# EAGLE design Einbau_2out_0.1 (EAGLE 5.04)
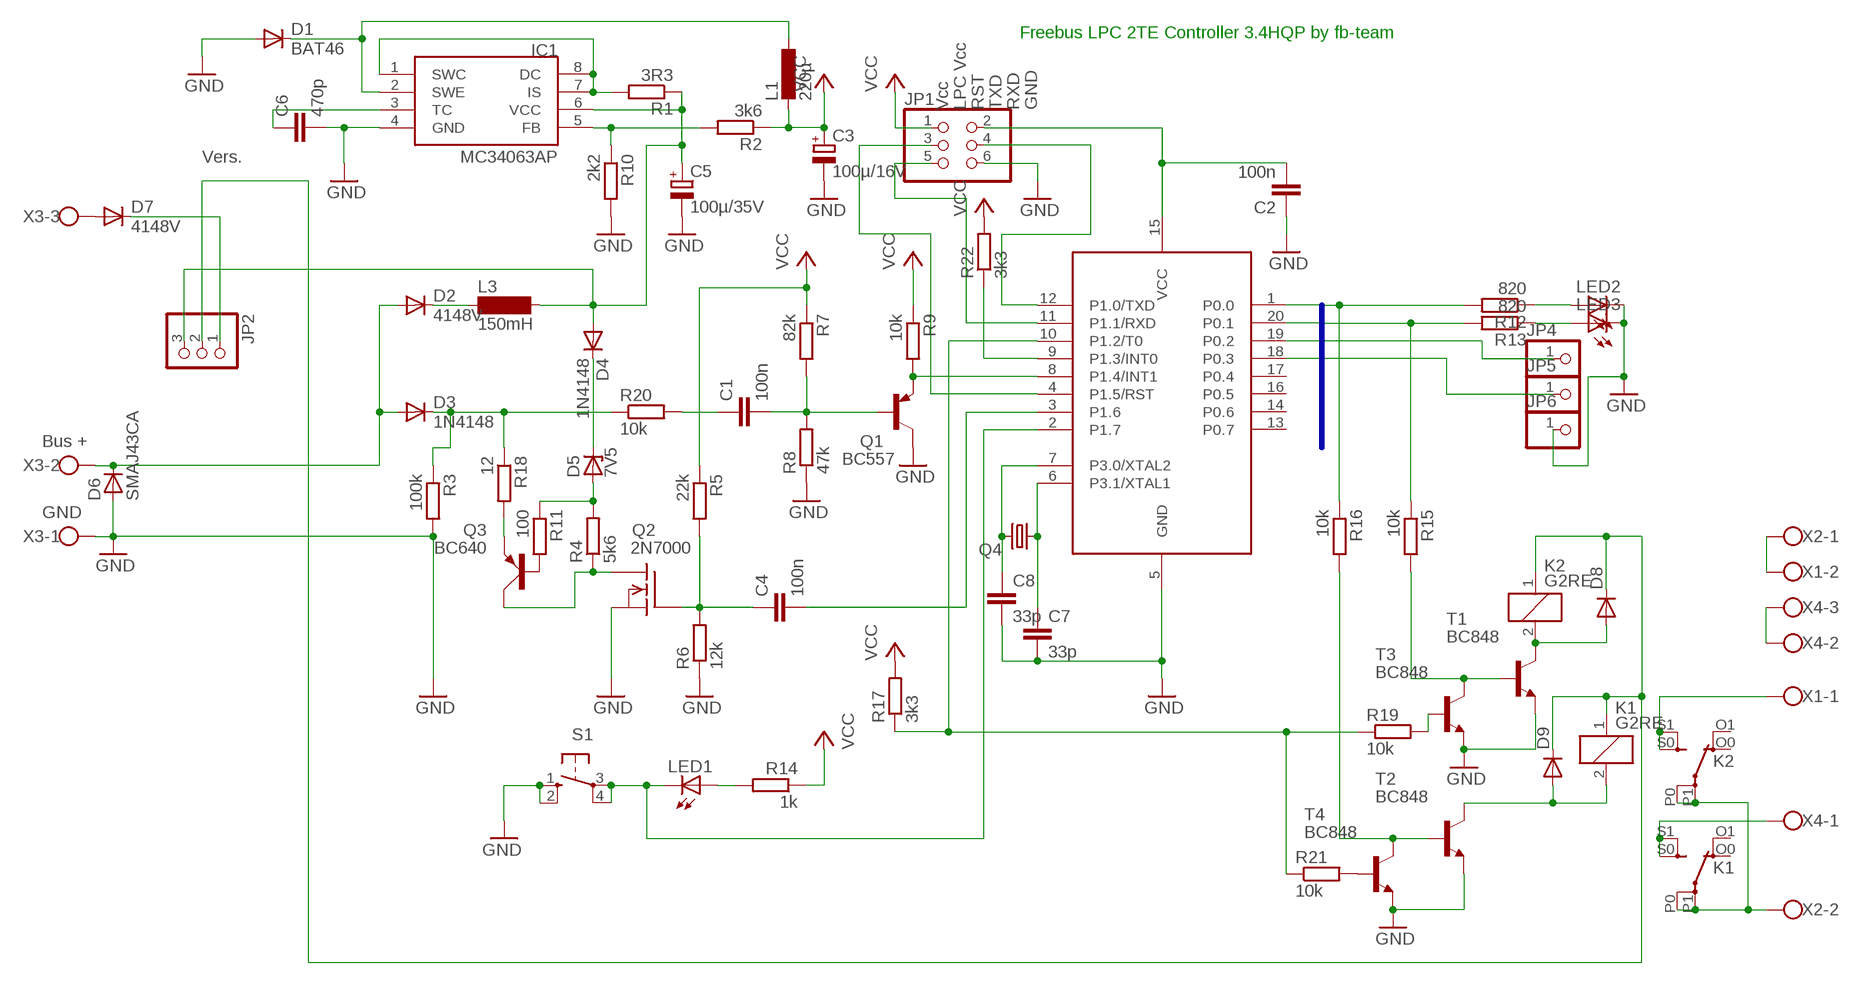
[diagram p0: schematic, sheet 1]

## Parts
C1  100n  C-EU050-024X044  [C050-024X044]
C2  100n  C-EU050-024X044  [C050-024X044]
C3  100µ/16V  CPOL-EUE2.5-5  [E2,5-5]
C4  100n  C-EU050-024X044  [C050-024X044]
C5  100µ/35V  CPOL-EUE3.5-8  [E3,5-8]
C6  470p  C-EU025-024X044  [C025-024X044]
C7  33p  C-EU025-025X050  [C025-025X050]
C8  33p  C-EU025-025X050  [C025-025X050]
D1  BAT46  BAT81  [DO34-7]
D2  4148V  1N41481448V  [D-2.5]
D3  1N4148  1N41481448V  [D-2.5]
D4  1N4148  1N41481448V  [D-2.5]
D5  7V5  ZPD  [DO35Z10]
D6  SMAJ43CA  D-SMB  [SMB]
D7  4148V  1N41481448V  [D-2.5]
D8  DIODE-MINIMELF  [MINIMELF]
D9  DIODE-MINIMELF  [MINIMELF]
IC1  MC34063AP  [DIL08]
JP1  PINHD-2X3  [2X03]
JP2  PINHD-1X3  [1X03]
JP4  PINHD-1X1  [1X01]
JP5  PINHD-1X1  [1X01]
JP6  PINHD-1X1  [1X01]
K1  G2RE  [G2RE]
K2  G2RE  [G2RE]
L1  220µ  L-EU0207/5V  [0207/5V]
L3  150mH  BS11  [BS11]
LED1  LED3MM  [LED3MM]
LED2  LED3MM  [LED3MM]
LED3  LED3MM  [LED3MM]
Q1  BC557  [TO92]
Q2  2N7000  VN2222KM  [TO237]
Q3  BC640  [SOT54D]
Q4  CRYSTALHC49S  [HC49/S]
R1  3R3  R-EU_0207/2V  [0207/2V]
R2  3k6  R-EU_0207/5V  [0207/5V]
R3  100k  R-EU_0207/2V  [0207/2V]
R4  5k6  R-EU_0207/2V  [0207/2V]
R5  22k  R-EU_0207/2V  [0207/2V]
R6  12k  R-EU_0207/2V  [0207/2V]
R7  82k  R-EU_0207/2V  [0207/2V]
R8  47k  R-EU_0207/2V  [0207/2V]
R9  10k  R-EU_0207/2V  [0207/2V]
R10  2k2  R-EU_0207/2V  [0207/2V]
R11  100  R-EU_0207/2V  [0207/2V]
R12  820  R-EU_R1206  [R1206]
R13  820  R-EU_R1206  [R1206]
R14  1k  R-EU_0207/2V  [0207/2V]
R15  10k  R-EU_R1206  [R1206]
R16  10k  R-EU_R1206  [R1206]
R17  3k3  R-EU_0207/5V  [0207/5V]
R18  12  R-EU_0207/2V  [0207/2V]
R19  10k  R-EU_R1206  [R1206]
R20  10k  R-EU_0207/2V  [0207/2V]
R21  10k  R-EU_R1206  [R1206]
R22  3k3  R-EU_0207/5V  [0207/5V]
S1  10-XX  [B3F-10XX]
T1  BC848  [SOT23]
T2  BC848  [SOT23]
T3  BC848  [SOT23]
T4  BC848  [SOT23]
U1  89LPC922  [DIL20]
X1  W237-02P  [W237-132]
X2  W237-02P  [W237-132]
X3  W237-3E  [W237-3E]
X4  W237-03P  [W237-133]

## Nets
EIB+: D2.A D3.A D6.1(C) X3.2
GND: C2.1 C3.- C5.- C6.2 C7.2 C8.2 D1.A D6.2(A) IC1.4(GND) JP1.6 JP6.1 LED2.K(C) LED3.K(C) Q1.3(C) Q2.3(S) R3.2 R6.1 R8.1 R10.2 S1.1(S) S1.2(S1) T1.2(E) T2.2(E) T3.2(E) T4.2(E) U1.5(GND) X3.1
HAND: R22.1 U1.9(P1.3/INT0)
N$1: Q1.1(E) R9.2 U1.8(P1.4/INT1)
N$2: C1.2 Q1.2(B) R7.2 R8.2
N$3: R21.2 T4.1(B)
N$4: D3.C R3.1 R18.1 R20.1
N$5: C4.2 U1.3(P1.6)
N$6: X4.2 X4.3
N$7: LED1.K(C) S1.3(P) S1.4(P1) U1.2(P1.7)
N$8: IC1.1(SWC) IC1.7(IS) IC1.8(DC) R1.2
N$9: LED1.A R14.2
N$10: C5.+ D4.A IC1.6(VCC) JP2.3 L3.2 R1.1
N$11: IC1.5(FB) R2.2 R10.1
N$12: D1.C IC1.2(SWE) L1.1
N$13: D2.C L3.1
N$14: C6.1 IC1.3(TC)
N$15: D4.C D5.C
N$16: X1.2 X2.1
N$17: K1.S0(2:S) K1.S1(2:S) X4.1
N$19: D9.A K1.2 T2.3(C)
N$20: LED2.A R12.1
N$21: LED3.A R13.1
N$23: D7.C JP2.1
N$24: D8.A K2.2 T1.3(C)
N$25: D5.A R4.2 R11.1
N$26: Q2.1(D) Q3.C R4.1
N$27: K2.S0(2:S) K2.S1(2:S) X1.1
N$28: Q3.B R11.2
N$29: JP1.4 U1.12(P1.0/TXD)
N$30: JP1.5 U1.11(P1.1/RXD)
N$31: JP1.3 U1.4(P1.5/RST)
N$32: C2.2 JP1.2 U1.15(VCC)
N$33: Q3.E R18.2
N$34: C4.1 Q2.2(G) R5.2 R6.2
N$35: R15.2 T1.1(B) T3.3(C)
N$36: D7.A X3.3
N$37: R16.2 T2.1(B) T4.3(C)
N$38: JP4.1 U1.19(P0.2)
N$39: JP5.1 U1.18(P0.3)
N$41: C1.1 R20.2
N$43: R19.2 T3.1(B)
N$46: K1.P0(2:P) K1.P1(2:P) K2.P0(2:P) K2.P1(2:P) X2.2
P0.0: R12.2 R16.1 U1.1(P0.0)
P0.1: R13.2 R15.1 U1.20(P0.1)
PWM: R17.1 R19.1 R21.1 U1.10(P1.2/T0)
VCC: C3.+ JP1.1 L1.2 R2.1 R5.1 R7.1 R9.1 R14.1 R17.2 R22.2
VDD_IN: D8.C D9.C JP2.2 K1.1 K2.1
XTAL1: C7.1 Q4.1 U1.6(P3.1/XTAL1)
XTAL2: C8.1 Q4.2 U1.7(P3.0/XTAL2)
Unconnected: K1.O0(2:O) K1.O1(2:O) K2.O0(2:O) K2.O1(2:O) U1.13(P0.7) U1.14(P0.6) U1.16(P0.5) U1.17(P0.4)

## Buses
P0.[0..3]

## Notes on the sheet
- Freebus LPC 2TE Controller 3.4HQP by fb-team
- Vcc | LPC Vcc | RST | TXD | RXD | GND
- Vers.
- Bus +
- GND

## Library data of the parts
C1 C2 C4 C6-C8 = rcl:C-EU: CAPACITOR, European symbol
C3 C5 = rcl:CPOL-EU: POLARIZED CAPACITOR, European symbol
D1 = diode:BAT81: DIODE barrier diode
D2-D4 D7 = diode:1N4148: DIODE high speed (Philips)
D5 = diode:ZPD: Z DIODE 500 mW
D6 = semicon-smd-ipc:D-: DIODE unfilled
D8 D9 = diode:DIODE-: DIODE
IC1 = mc34063:MC34063
JP1 = pinhead:PINHD-2X3: PIN HEADER
JP2 = pinhead:PINHD-1X3: PIN HEADER
JP4-JP6 = pinhead:PINHD-1X1: PIN HEADER
K1 K2 = relay:G2RE: RELAY 1 x switch, high current, Omron
L1 = rcl:L-EU: INDUCTOR, European symbol
L3 = inductor-neosid:BS: INDUCTOR nominal inductance, magnetically screened
LED1-LED3 = led:LED: LED OSRAM: - CHIPLED LG R971, LG N971, LY N971, LG Q971, LY Q971, LO R971, LY R971 LH N974, LH R974 LS Q976, LO Q976, LY Q976 LO Q996 - Hyper CHIPLED LW Q18S LB Q993, LB Q99A, LB R99A - SideLED LS A670, LO A670, LY A670, LG A670, LP A670 LB A673, LV A673, LT A673, LW A673 LH A674 LY A675 LS A676, LA A676, LO A676, LY A676, LW A676 LS A679, LY A679, LG A679 - Hyper Micro SIDELED® LS Y876, LA Y876, LO Y876, LY Y876 LT Y87S - SmartLED LW L88C, LW L88S LB L89C, LB L89S, LG L890 LS L89K, LO L89K, LY L89K LS L896, LA L896, LO L896, LY L896 - TOPLED LS T670, LO T670, LY T670, LG T670, LP T670 LSG T670, LSP T670, LSY T670, LOP T670, LYG T670 LG T671, LOG T671, LSG T671 LB T673, LV T673, LT T673, LW T673 LH T674 LS T676, LA T676, LO T676, LY T676, LB T676, LH T676, LSB T676, LW T676 LB T67C, LV T67C, LT T67C, LS T67K, LO T67K, LY T67K, LW E67C LS E67B, LA E67B, LO E67B, LY E67B, LB E67C, LV E67C, LT E67C LW T67C LS T679, LY T679, LG T679 LS T770, LO T770, LY T770, LG T770, LP T770 LB T773, LV T773, LT T773, LW T773 LH T774 LS E675, LA E675, LY E675, LS T675 LS T776, LA T776, LO T776, LY T776, LB T776 LHGB T686 LT T68C, LB T68C - Hyper Mini TOPLED® LB M676 - Mini TOPLED Santana® LG M470 LS M47K, LO M47K, LY M47K Source: http://www.osram.convergy.de - LUMILED® LXK2-PW12-R00, LXK2-PW12-S00, LXK2-PW14-U00, LXK2-PW14-V00 LXK2-PM12-R00, LXK2-PM12-S00, LXK2-PM14-U00 LXK2-PE12-Q00, LXK2-PE12-R00, LXK2-PE12-S00, LXK2-PE14-T00, LXK2-PE14-U00 LXK2-PB12-K00, LXK2-PB12-L00, LXK2-PB12-M00, LXK2-PB14-N00, LXK2-PB14-P00, LXK2-PB14-Q00 LXK2-PR12-L00, LXK2-PR12-M00, LXK2-PR14-Q00, LXK2-PR14-R00 LXK2-PD12-Q00, LXK2-PD12-R00, LXK2-PD12-S00 LXK2-PH12-R00, LXK2-PH12-S00 LXK2-PL12-P00, LXK2-PL12-Q00, LXK2-PL12-R00 Source: www.luxeon.com
Q1 = transistor-pnp:BC557: PNP Transistor
Q2 = transistor-fet:VN2222KM: N-Channel Enhancement MOSFET (VMOS); 60V; 0,5A; 7,5Ohm
Q3 = transistor-small-signal:BC640: PNP TRANSISTOR
Q4 = crystal:CRYSTAL: CRYSTAL
R1-R22 = rcl:R-EU_: RESISTOR, European symbol
S1 = switch-omron:10-XX: OMRON SWITCH
T1-T4 = transistor:BC848: NPN TRANSISTOR
U1 = micro-philips:89LPC922
X1 X2 = con-wago-508:W237-02P: WAGO SREW CLAMP
X3 = con-wago-508:W237-3E: WAGO SREW CLAMP
X4 = con-wago-508:W237-03P: WAGO SREW CLAMP

## Board
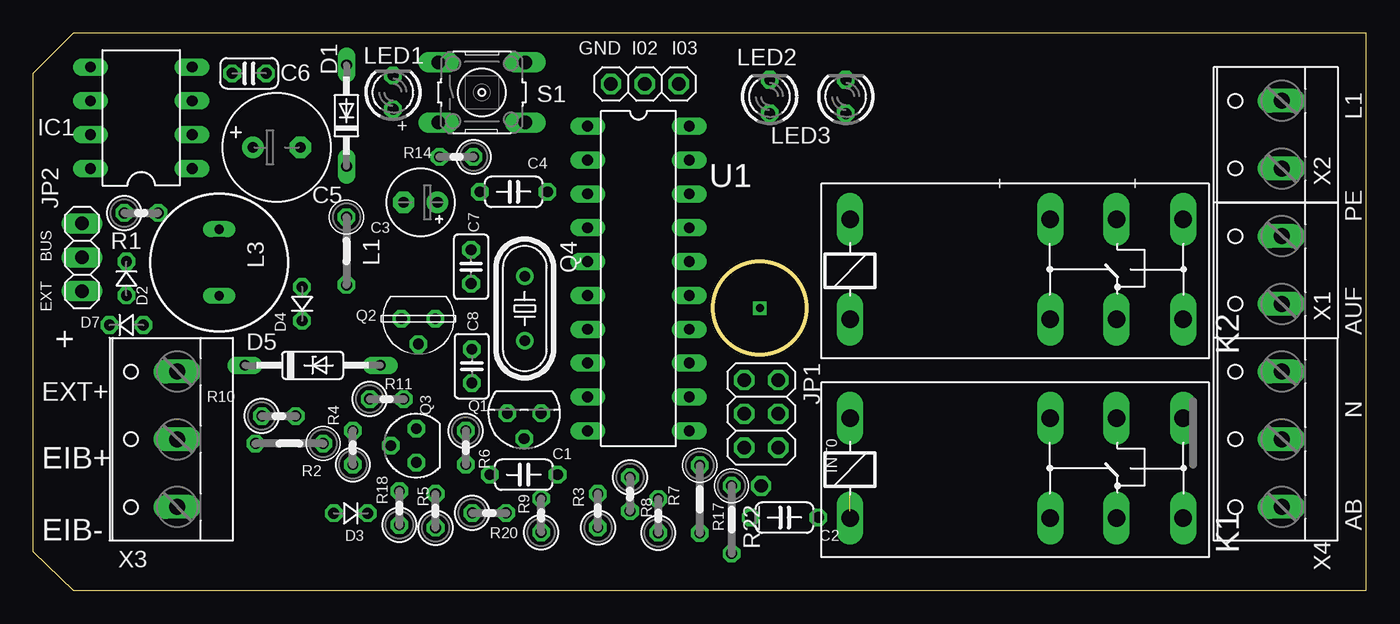
[diagram p1: board, top side]
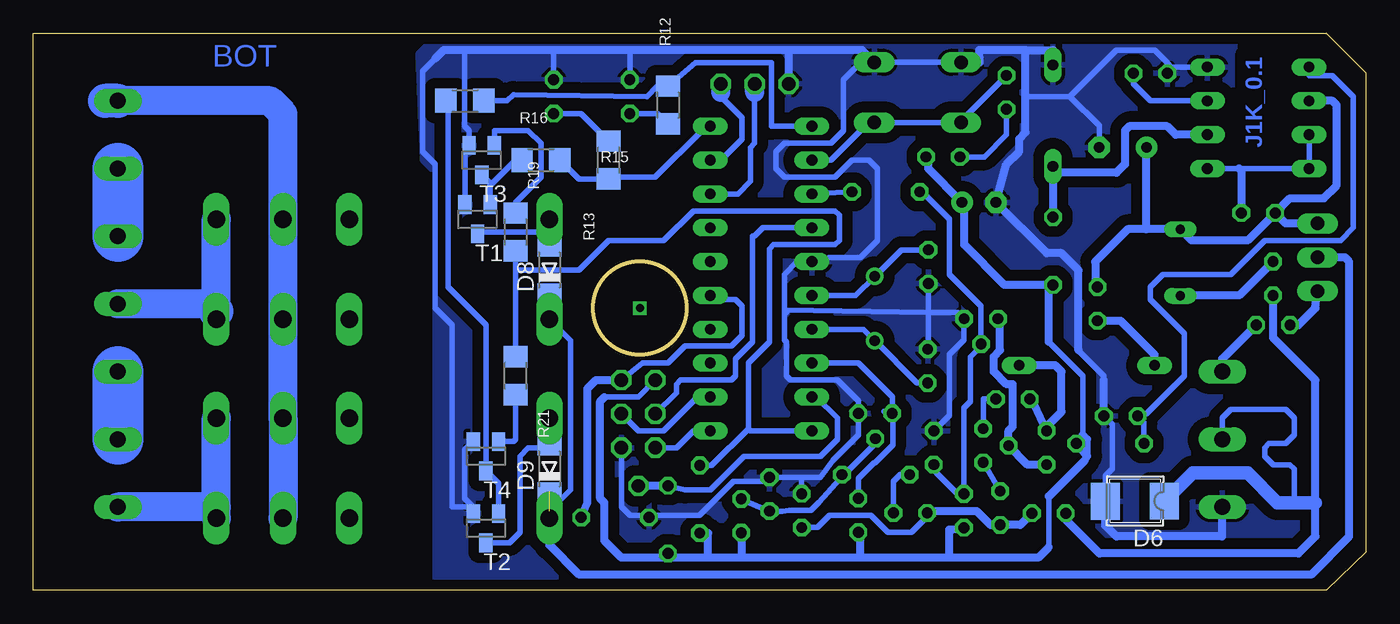
[diagram p2: board, bottom side, seen from below]

Size 100 x 41.8 mm. Coordinates in mm from the lower left corner, seen from the top.
Outline: 0,2.9 3,0 100,0 100,41.8 3,41.8 0,38.8 0,2.9
Outline: circle at 54.5,21.17 radius 3.49
Copper layers (1*16): Top 0.035mm / dielectric 1.5mm / Bottom 0.035mm
Design rules "default *": minimum track width 10mil, minimum drill 24mil, track to track 8mil, track to pad 8mil, pad to pad 8mil, via to via 8mil, smd to smd 8mil, copper to edge 25mil, drill to drill 8mil, minimum pad ring 10mil, minimum via ring 8mil, stop-mask expansion 4mil, vias tented up to drill 0mil, thermal gap 10mil

### Footprints (pad centres in the part's own frame; a part is rotated, then mirrored left to right if it is on the bottom)
C050-024X044 = drill 0.813 octagon: 1 -2.54,0; 2 2.54,0
E2,5-5 = drill 0.813 pad 1.6 round: + -1.27,0 | drill 0.813 pad 1.6 octagon: - 1.27,0
E3,5-8 = drill 0.813 pad 1.6 round: + -1.778,0 | drill 0.813 pad 1.6 octagon: - 1.778,0
C025-024X044 = drill 0.813 octagon: 1 -1.27,0; 2 1.27,0
C025-025X050 = drill 0.813 octagon: 1 -1.27,0; 2 1.27,0
DO34-7 = drill 0.813 long: A 3.81,0; C -3.81,0
D-2.5 = drill 0.813 octagon: A 1.27,0; C -1.27,0
DO35Z10 = drill 0.813 long: A 5.08,0; C -5.08,0
SMB = smd 2.159 x 2.743: 1 -2.311,-0.127; 2 2.108,-0.102
MINIMELF = smd 1.4 x 1.8: A 1.7,0; C -1.7,0
DIL08 = drill 0.813 long: 1 -3.81,-3.81; 2 -1.27,-3.81; 3 1.27,-3.81; 4 3.81,-3.81; 5 3.81,3.81; 6 1.27,3.81; 7 -1.27,3.81; 8 -3.81,3.81
2X03 = drill 1.016 octagon: 1 -2.54,-1.27; 2 -2.54,1.27; 3 0,-1.27; 4 0,1.27; 5 2.54,-1.27; 6 2.54,1.27
1X03 = drill 1.016 long: 1 -2.54,0; 2 0,0; 3 2.54,0
1X01 = drill 1.016 octagon: 1 0,0
G2RE = drill 1.321 long: 1 -2.54,-3.683; 2 -2.54,3.81; O0 12.471,-3.683; O1 12.471,3.81; P0 17.45,-3.683; P1 17.45,3.81; S0 22.454,-3.683; S1 22.454,3.81
0207/5V = drill 0.813 octagon: 1 -2.54,0; 2 2.54,0
BS11 = drill 0.7 long: 1 -2.5,0; 2 2.5,0
LED3MM = drill 0.813 octagon: A -1.27,0; K 1.27,0
TO92 = drill 0.813 octagon: 1 1.27,0; 2 0,1.905; 3 -1.27,0
TO237 = drill 0.813 octagon: 1 1.27,0; 2 0,1.905; 3 -1.27,0
SOT54D = drill 0.813 octagon: B 1.27,0; C 0,1.905; E -1.27,0
HC49/S = drill 0.813 round: 1 -2.413,0; 2 2.413,0
0207/2V = drill 0.813 octagon: 1 -1.27,0; 2 1.27,0
R1206 = smd 1.6 x 1.803: 1 -1.422,0; 2 1.422,0
B3F-10XX = drill 1.016 long: 1 -3.251,2.261; 2 3.251,2.261; 3 -3.251,-2.261; 4 3.251,-2.261
SOT23 = smd 1 x 1.4: 1 -0.95,-1.1; 2 0.95,-1.1; 3 0,1.1
DIL20 = drill 0.813 long: 1 -11.43,-3.81; 2 -8.89,-3.81; 3 -6.35,-3.81; 4 -3.81,-3.81; 5 -1.27,-3.81; 6 1.27,-3.81; 7 3.81,-3.81; 8 6.35,-3.81; 9 8.89,-3.81; 10 11.43,-3.81; 11 11.43,3.81; 12 8.89,3.81; 13 6.35,3.81; 14 3.81,3.81; 15 1.27,3.81; 16 -1.27,3.81; 17 -3.81,3.81; 18 -6.35,3.81; 19 -8.89,3.81; 20 -11.43,3.81
W237-132 = drill 1.194 long: 1 -2.54,-0.635; 2 2.54,-0.635
W237-3E = drill 1.194 long: 1 -5.08,-0.635; 2 0,-0.635; 3 5.08,-0.635
W237-133 = drill 1.194 long: 1 -5.08,-0.635; 2 0,-0.635; 3 5.08,-0.635

### Placement (x,y rotation side)
C1  36.8,8.67 0 top
C2  56.36,5.46 0 top
C3  29.05,29.11 180 top
C4  36.04,29.9 0 top
C5  18.26,33.24 0 top
C6  16.19,38.79 180 top
C7  32.85,24.28 270 top
C8  32.9,16.82 90 top
D1  23.5,35.62 90 top
D2  6.99,23.39 270 top
D3  23.81,5.77 180 top
D4  20.16,21.49 90 top
D5  20.96,16.89 0 top
D6  17.46,6.57 180 bottom
D7  6.99,19.9 0 top
D8  61.28,24.03 90 bottom
D9  61.28,9.11 90 bottom
IC1  8.1,35.46 90 top
JP1  54.61,13.24 270 top
JP2  3.65,24.98 90 top
JP4  48.42,38 0 top
JP5  45.88,38 0 top
JP6  43.34,38 0 top
K1  63.82,9.11 0 top
K2  63.82,24.03 0 top
L1  23.49,25.46 270 top
L3  13.94,24.6 90 top
LED1  26.99,37.37 90 top
LED2  55.24,37.05 90 top
LED3  60.96,37.05 90 top
Q1  36.83,13.28 180 top
Q2  28.89,20.38 180 top
Q3  28.73,10.85 90 top
Q4  36.87,21.14 270 top
R1  8.1,28.32 0 top
R2  19.21,11.01 180 top
R3  42.36,5.97 90 top
R4  23.97,10.69 90 top
R5  30.18,5.96 90 top
R6  32.44,10.7 270 top
R7  46.89,5.58 90 top
R8  44.77,7.2 270 top
R9  38.1,5.61 90 top
R10  18.42,13.08 0 top
R11  26.51,14.35 0 top
R12  52.39,36.41 90 bottom
R13  56.83,32.28 270 bottom
R14  31.75,32.52 180 top
R15  61.91,32.28 180 bottom
R16  67.63,36.73 180 bottom
R17  50,6.83 270 top
R18  27.46,6.17 90 top
R19  63.82,26.89 90 bottom
R20  34.2,5.8 0 top
R21  63.82,16.09 270 bottom
R22  52.39,5.3 270 top
S1  33.66,37.36 0 top
T1  66.67,27.84 180 bottom
T2  66.04,4.66 180 bottom
T3  66.36,32.28 180 bottom
T4  66.04,10.06 180 bottom
U1  45.4,23.39 270 top
X1  93.03,24.03 90 top
X2  93.03,34.19 90 top
X3  10.16,11.33 90 top
X4  93.03,11.33 90 top

### Tracks (layer width: path | path; a pad name or v marks a point on that pad's centre or on a via)
EIB+
  Bottom 0.406: X3.2 10.79,12.92 10.16,13.55 6.03,13.55 5.4,12.92 5.4,11.65 6.03,11.01 7.3,11.01 7.62,10.7 7.62,10.06 6.99,9.43 5.71,9.43 5.4,9.11 5.4,6.57
  Bottom 0.61: D3.A 22.54,5.3 20,2.76 5.08,2.76 3.81,4.03 3.81,6.57 3.81,15.78 6.99,18.95 6.99,22.44 D2.A
  Bottom 1.016: D6.1 15.11,6.7 13.02,8.79 8.89,8.79 6.67,6.57 5.4,6.57 3.81,6.57
GND
  Bottom 0.406: U1.5 42.7,24.66 43.66,23.71 43.66,21.01 | 42.23,8.47 40.96,8.47 40.01,9.74 38.1,11.65 Q1.3 38.1,14.19 39.69,15.78 43.18,15.78 43.5,16.09 43.5,18.63 43.66,18.79 43.66,21.01 | 42.23,8.47 R8.1 45.09,8.16 47.47,8.16 50.01,5.62 54.29,5.62 C2.1 54.61,5.62 55.24,5.62 55.88,6.25 JP1.6 | Q2.3 | 43.66,21.01 43.5,20.85 | U1.5 | U1.5 40.64,24.66 40.32,24.98 37.94,24.98 36.67,26.25 36.67,31.65 37.31,32.28 38.58,32.28 39.85,31.01 43.66,31.01 44.29,31.65 44.29,32.92 43.66,33.55 40.16,33.55 39.21,34.51 39.21,38.32 37.9,39.62 S1.2 S1.1 | R6.1 31.27,13.13 31.27,17.68 30.16,18.79 Q2.3 | Q2.3 30.64,20.85 32.86,20.85 | 43.66,21.01 32.86,20.85 | C7.2 32.86,20.85 | C8.2 32.86,18.09 32.86,20.85 | R10.2 19.05,12.44 19.05,9.11 19.57,8.59 D6.2 | 19.68,15.78 19.68,16.09 21.59,18 | C5.- 20.03,34.86 22.23,37.05 | 25.56,37.05 22.23,37.05 | 14.76,38.63 C6.2 14.92,39.59 | 14.92,39.59 15.88,40.54 18.73,40.54 22.23,37.05 | IC1.4 14.61,39.27 14.92,39.59 | R3.2 42.35,8.35 42.23,8.47 | 66.99,6.25 T2.2 | 66.99,6.25 67.63,6.89 67.63,10.52 T4.2 | T1.2 67.62,33.07 T3.2 67.31,34.5 67.63,34.82 67.63,40.54 | 66.99,6.25 68.58,6.25 68.58,19.9 69.85,21.17 69.85,31.97 70.8,32.92 70.8,38.95 69.85,39.91 | 55.24,40.54 LED2.K | 60.96,40.54 LED3.K
  Bottom 0.61: 25.56,40.54 23.5,40.54 23.5,39.75 | 25.56,40.54 29.05,40.54 29.01,39.62 S1.1 | X3.1 10.79,4.03 18.73,4.03 19.57,4.87 D6.2 | 43.34,40.54 37.82,40.54 S1.2 | 43.34,40.54 JP6.1 | 19.68,15.78 19.68,15.14 R10.2 | 25.56,40.54 25.56,37.05 25.56,34.35 26.04,33.87 26.04,32.92 26.99,31.97 C3.- 23.97,25.3 22.86,25.3 21.59,24.03 21.59,18 | 43.34,40.54 55.24,40.54 60.96,40.54 67.63,40.54 69.22,40.54 69.85,39.91
  pour Bottom (isolate 0.813): 0,3.07 0,38.95 2.86,41.81 69.85,41.49 71.12,40.22 70.8,32.28 69.85,31.33 69.85,0.54 2.54,0.54
HAND  (via drill 1)
  Bottom 0.406: U1.9 41.27,14.51 39.69,12.92 39.69,11.33 40.96,10.06 46.67,10.06 49.21,7.52 51.12,7.52 R22.1
  Bottom 0.61: R22.1 v54.61,7.84
N$1
  Bottom 0.406: R9.2 38.1,8.39 36.91,9.57 36.85,9.57 35.51,10.91 35.51,13.41 36.17,13.44 Q1.1 35.56,14.51 38.1,17.04 U1.8 | U1.8
N$2
  Bottom 0.406: 39.62,8.69 39.31,8.36 C1.2 39.48,8.36 | 39.48,8.36 39.48,8.69 | 39.48,8.36 41.06,6.61 41.66,6.01 43.27,6.01 43.82,5.93 R8.2 46.29,6.57 R7.2 | 39.48,8.36 38.85,8.99 36.51,11.33 36.87,11.33 Q1.2
N$3
  Bottom 0.406: T4.1 63.99,11.16 63.82,11.33 R21.2
N$4
  Bottom 0.406: R3.1 42.27,4.7 42.27,4.71 41.16,4.71 40.27,5.61 37.16,5.61 35.9,4.35 34.13,4.35 32.93,5.54 R20.1 32.8,5.93
  Bottom 0.61: 32.8,5.93 29.21,5.93 28.18,4.9 R18.1 25.96,4.9 D3.C
N$5
  Bottom 0.406: U1.3 | C4.2 U1.3 | U1.3
N$6
  Bottom 3.81: X4.3 X4.2
N$7
  Bottom 0.406: U1.2 | U1.2 40.16,32.28 37.34,35.1 S1.4 S1.3 30.4,35.22 LED1.K
N$8
  Bottom 0.406: IC1.1 9.84,31.65 9.53,31.65 IC1.8 IC1.7
  Bottom 0.61: R1.2 9.37,31.49 9.53,31.65
N$9
  Bottom 0.406: LED1.A 26.99,34.19 28.65,32.52 R14.2
N$10
  Bottom 0.61: JP2.3 6.03,27.52 R1.1 | R1.1 | R1.1 8.89,26.25 13.1,26.25 L3.2 16.51,27.1 | R1.1 5.71,29.43 3.17,29.43 2.22,30.38 2.22,36.41 2.54,36.73 IC1.6 | IC1.6 | 16.51,27.1 17.89,27.1 20.32,24.66 20.32,22.92 D4.A | C5.+ 16.48,27.13 16.51,27.1
N$11
  Bottom 0.406: R2.2 16.67,12.6 R10.1 16.51,13.24 13.65,16.09 13.65,19.27 16.19,21.81 16.19,22.76 15.24,23.71 10.16,23.71 7.62,26.25 1.91,26.25 0.95,27.2 0.95,37.05 2.54,38.63 4.29,38.63 IC1.5
N$12
  Bottom 0.61: L1.1 D1.C 23.02,31.33 18.73,31.33 18.1,31.97 18.1,34.51 17.78,34.82 14.92,34.82 14.29,34.19 IC1.2 | L1.1
N$13
  Bottom 0.61: D2.C 9.53,22.12 13.28,22.12 L3.1
N$14
  Bottom 0.406: IC1.3 16.19,36.73 17.46,38 C6.1
N$15
  Bottom 0.61: D5.C 15.88,17.68 18.41,20.22 D4.C | D4.C
N$16
  Bottom 3.81: X2.1 X1.2
N$17
  Bottom 1.778: K1.S0 86.27,6.25
  Bottom 2.184: 86.27,6.25 X4.1 | K1.S0 K1.S1
N$19
  Bottom 0.406: 60.96,10.38 60.96,10.49 D9.A | D9.A K1.2 | T2.3 64.28,3.56 63.5,4.35 63.5,10.06 62.87,10.7 61.39,10.7 D9.A
N$20
  Bottom 0.406: LED2.A 53.17,35.78 R12.1
N$21
  Bottom 0.406: LED3.A 58.9,35.78 R13.1
N$23
  Bottom 0.61: JP2.1 3.81,21.17 5.08,19.9 D7.C
N$24
  Bottom 0.406: D8.A K2.2 60.96,27.52 61.59,26.89 66.36,26.89 66.5,26.74 T1.3
N$25
  Bottom 0.61: R11.1 24.92,14.03 24.18,12.42 | R4.2 24.18,12.42 | 24.18,12.42 23.84,12.42 22.86,13.39 22.86,16.41 23.34,16.89 D5.A | D5.A
N$26
  Bottom 0.61: R4.1 25.4,9.43 Q3.C 26.83,11.96 26.51,12.28 26.51,15.46 26.99,15.46 27.94,16.41 27.94,17.52 27.46,18 27.46,20.22 Q2.1
N$27
  Bottom 1.778: 86.27,20.85 K2.S0 86.4,20.22
  Bottom 2.184: X1.1 86.91,21.49 86.32,20.9 86.27,20.85 | 86.27,20.94 K2.S1
  Bottom 2.54: 86.32,20.9 86.27,20.94
N$28
  Bottom 0.406: Q3.B 28.73,14.35 R11.2
N$29
  Bottom 0.406: JP1.4 54.61,11.96 52.7,11.96 50.16,14.51 U1.12 | U1.12
N$30
  Bottom 0.406: U1.11 50.48,11.96 51.75,10.7 JP1.5
N$31
  Bottom 0.406: U1.4 45.24,27.2 45.88,26.57 46.04,26.57 46.04,18.63 47.31,17.36 47.31,16.09 47.62,15.78 51.44,15.78 51.75,15.46 51.75,14.82 JP1.3
N$32
  Bottom 0.406: U1.15 48.9,21.81 47.31,21.81 46.83,21.33 46.83,19.11 47.62,18.31 51.12,18.31 52.39,17.04 54.29,17.04 JP1.2
  Bottom 0.61: JP1.2 57.78,15.78 58.42,15.14 58.42,6.57 C2.2
N$33
  Bottom 0.406: R18.2 Q3.E
N$34
  Bottom 0.406: 28.89,18.31 | Q2.2 | Q2.2 28.89,18.31 | Q2.2 | Q2.2 28.89,21.33 31.27,23.71 31.27,27.84 33.34,29.9 C4.1 | R6.2 32.23,8.79 30.66,7.23 R5.2 30.18,13.69 29.69,14.19 29.69,17.52 28.89,18.31 | 28.89,18.31 Q2.2
N$35
  Bottom 0.406: T1.1 65.72,30.38 | 65.72,30.38 65.72,30.55 T3.3 | R15.2 63.82,32.28 65.72,30.38
N$36
  Bottom 0.61: X3.3 10.79,17.36 D7.A
N$37
  Bottom 0.406: T2.1 65.09,8.01 T4.3 66.04,19.9 68.9,22.76 68.9,36.58 R16.2
N$38
  Bottom 0.406: U1.19 48.42,32.28 46.83,33.87 46.83,35.46 48.42,37.05 48.42,37.37
  Bottom 1.422: 48.42,37.37 JP4.1
N$39
  Bottom 0.406: U1.18 47.15,29.74 46.2,30.7 46.2,33.24 45.88,33.55 45.88,37.37 | U1.18
  Bottom 1.422: 45.88,37.37 JP5.1
N$40  (via drill 0.6)
  other vias: 54.5,21.17
N$41
  Bottom 0.406: C1.1 34.92,8.67 34.94,8.69 35.47,8.16 R20.2
N$43
  Bottom 0.406: T3.1 65.41,34.5 65.41,34.51 62.87,34.51 61.91,33.55 61.91,31.01 63.82,29.11 R19.2
N$46
  Bottom 2.184: X2.2 82.23,36.73 81.27,35.77 K2.P1 K2.P0 K1.P1 K1.P0
  Bottom 2.54: X2.2 94.61,36.73
P0.0
  Bottom 0.406: U1.1 | U1.1 44.61,34.82 44.61,39.59 50.32,39.59 R12.2 53.19,37.83 53.98,37.05 63.98,37.2 64.45,36.73 R16.1
P0.1
  Bottom 0.406: U1.20 | U1.20 49.53,34.51 49.85,34.51 53.34,31.01 56.68,31.01 R13.2 59.07,30.86 R15.1
PWM
  Bottom 0.406: 46.35,12.12 46.35,17.04 44.77,18.63 44.77,25.62 44.45,25.93 39.85,25.93 39.53,26.25 39.53,28.16 39.85,28.47 50.48,28.47 52.7,26.25 56.83,26.25 59.05,24.03 63.82,24.03 | R17.1 49.11,9.37 46.35,12.12 | U1.10 46.2,11.96 46.35,12.12 | 63.82,24.03 R21.1 | 63.82,24.03 R19.1
VCC
  Bottom 0.406: 46.6,4.29 R7.1 | R5.1 31.11,4.66 | 23.81,3.23 23.81,7.04 | 21.27,11.65 21.27,16.09 23.81,18.63 | 57.15,14.51 54.61,14.51 JP1.1 | 52.39,2.44 R22.2
  Bottom 0.61: 31.27,2.44 37.94,2.44 | 37.94,2.44 46.83,2.44 | 46.83,2.44 49.37,2.44 | R17.2 49.37,4.28 49.37,2.44 | 46.6,4.29 46.83,4.2 46.83,2.44 | R9.1 37.94,4.19 37.94,2.44 | R5.1 31.27,4.55 31.27,2.44 | R14.1 32.86,32.37 32.86,31.65 C3.+ 30.16,28.63 30.16,25.93 27.15,22.92 L1.2 23.81,22.6 23.81,18.63 | 20.95,10.06 21.11,9.74 23.81,7.04 | 20.95,10.06 R2.1 | 23.81,3.23 24.61,2.44 31.27,2.44 | 20.95,10.06 20.95,11.33 21.27,11.65 | 49.37,2.44 52.39,2.44 55.88,2.44 57.15,3.71 57.15,6.57 57.47,6.89 57.47,14.19 57.15,14.51
VDD_IN  (1 unrouted)
  Bottom 0.406: 61.28,3.39 K1.1 61.28,5.93 59.69,7.52 59.69,18.76 K2.1 D8.C
  Bottom 0.61: 61.28,3.39 59.05,1.17 4.13,1.17 1.27,4.03 1.27,24.66 1.59,24.98 JP2.2
XTAL1
  Bottom 0.406: U1.6 | U1.6 38.3,22.12 Q4.1 34.88,25.55 C7.1
XTAL2
  Bottom 0.406: Q4.2 36.77,18.63 | U1.7 37.72,19.58 Q4.2 | C8.1 33.69,15.55 Q4.2

### Text on the board
Bottom: BOT | J1K_0.1
tPlace: GND | I02 | I03 | L1 | + | + | + | PE | BUS | AUF | EXT | + | EXT+ | N | EIB+ | INT0 | AB | EIB-
tDocu: * | optional für 2 fach out | * | 2 Schließer bestücken !